# Altium project 3d_printer_housing.PrjPcb
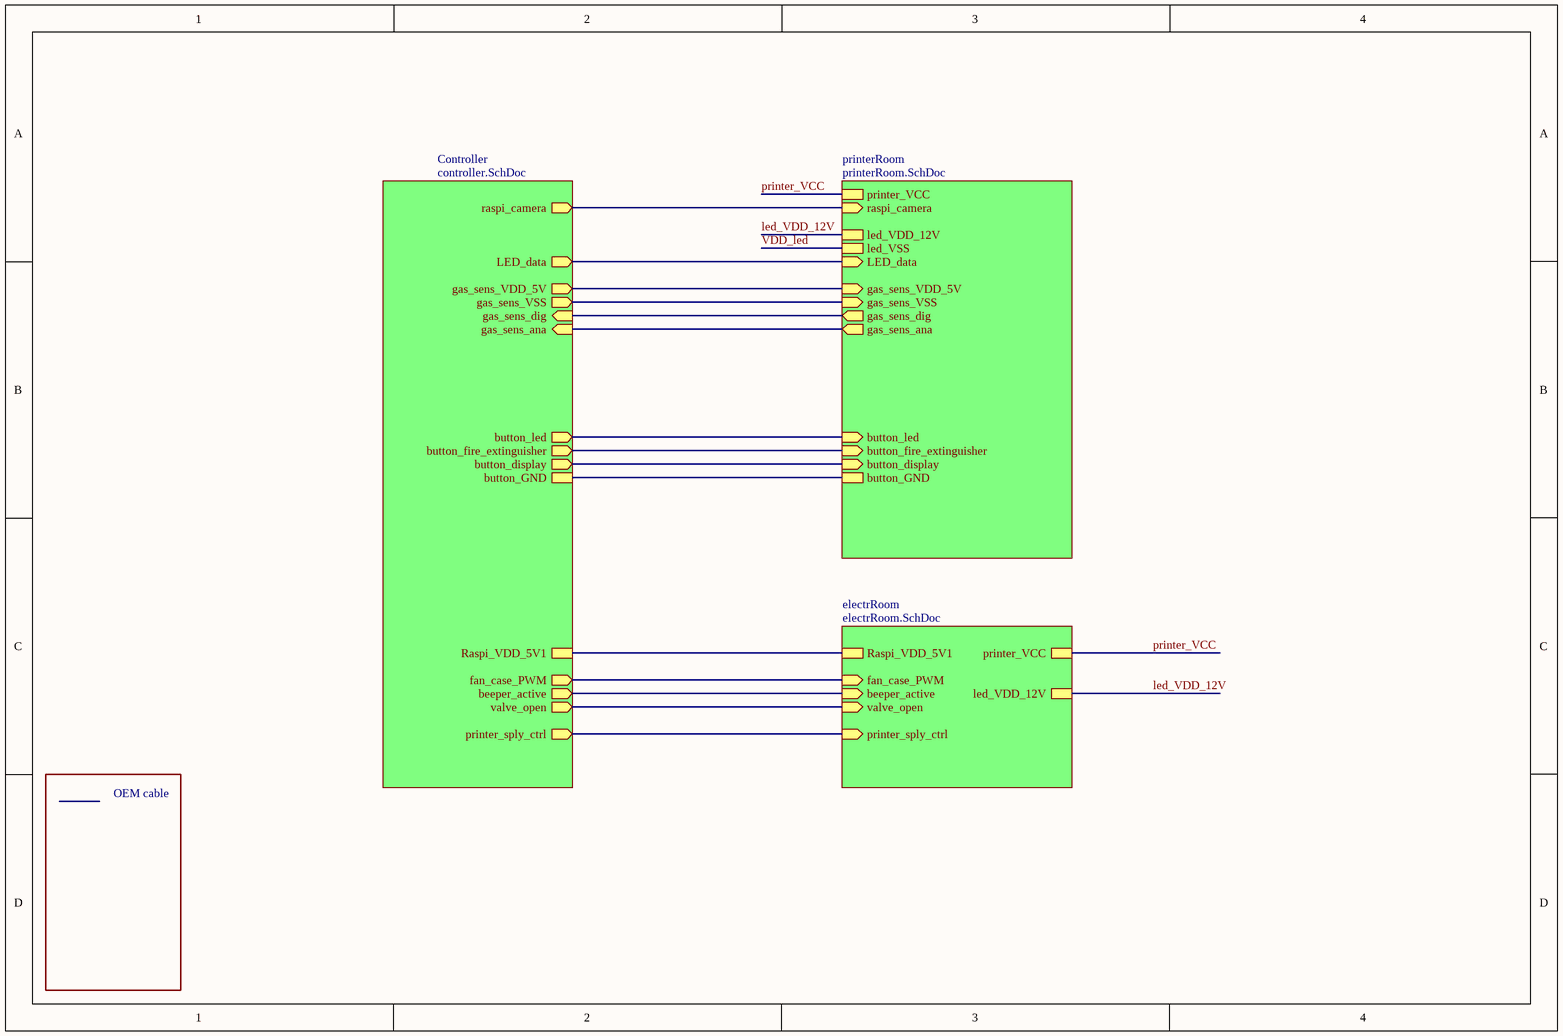
[diagram p0: 3d_printer_housing.SchDoc]
4 sheets, 5 parts. Net scope: hierarchical (ports join the sheet entries above them; power ports are global).
Sheets:
  3d_printer_housing.SchDoc
    Controller = controller.SchDoc
    electrRoom = electrRoom.SchDoc
    printerRoom = printerRoom.SchDoc

## Sheet 3d_printer_housing.SchDoc
size A4; SheetNumber: 1; SheetTotal: 3

### Sub-sheets
Controller = controller.SchDoc: gas_sens_dig (in), gas_sens_ana (in), button_display (out), button_led (out), LED_data (out), valve_open (out), beeper_active (out), button_fire_extinguisher (out), raspi_camera (out), gas_sens_VDD_5V (out), gas_sens_VSS (out), Raspi_VDD_5V1, button_GND, printer_sply_ctrl (out), fan_case_PWM (out)
electrRoom = electrRoom.SchDoc: printer_VCC, led_VDD_12V, valve_open (in), beeper_active (in), Raspi_VDD_5V1, fan_case_PWM (in), printer_sply_ctrl (in)
printerRoom = printerRoom.SchDoc: button_led (in), button_display (in), gas_sens_dig (out), gas_sens_ana (out), led_VDD_12V, LED_data (in), button_fire_extinguisher (in), button_GND, raspi_camera (in), gas_sens_VDD_5V (in), gas_sens_VSS (in), led_VSS, printer_VCC

### Nets
led_VDD_12V: sheet electrRoom/led_VDD_12V, sheet printerRoom/led_VDD_12V
VDD_led: sheet printerRoom/led_VSS
NetQ?#1_2: sheet Controller/fan_case_PWM, sheet electrRoom/fan_case_PWM
NetQ?#2_2: sheet Controller/printer_sply_ctrl, sheet electrRoom/printer_sply_ctrl
NetQ?#3_2: sheet Controller/valve_open, sheet electrRoom/valve_open
NetQ?#4_2: sheet Controller/beeper_active, sheet electrRoom/beeper_active
(unnamed): sheet Controller/gas_sens_dig, sheet printerRoom/gas_sens_dig
(unnamed): sheet Controller/gas_sens_ana, sheet printerRoom/gas_sens_ana
(unnamed): sheet Controller/button_display, sheet printerRoom/button_display
(unnamed): sheet Controller/button_led, sheet printerRoom/button_led
(unnamed): sheet Controller/LED_data, sheet printerRoom/LED_data
(unnamed): sheet Controller/button_fire_extinguisher, sheet printerRoom/button_fire_extinguisher
(unnamed): sheet Controller/gas_sens_VDD_5V, sheet printerRoom/gas_sens_VDD_5V
(unnamed): sheet Controller/gas_sens_VSS, sheet printerRoom/gas_sens_VSS
(unnamed): sheet Controller/button_GND, sheet printerRoom/button_GND

### Buses and harness runs
bus printer_VCC = sheet electrRoom/printer_VCC
bus printer_VCC = sheet printerRoom/printer_VCC
bus sheet Controller/raspi_camera = sheet printerRoom/raspi_camera
bus sheet Controller/Raspi_VDD_5V1 = sheet electrRoom/Raspi_VDD_5V1

### Notes on the sheet
- OEM cable

## Sheet controller.SchDoc
size A4; SheetNumber: 2; SheetTotal: 3; SPICEModelCacheHKYVZYBW: <root> / <DocumentId>HKYVZYBW</DocumentId> / </root>
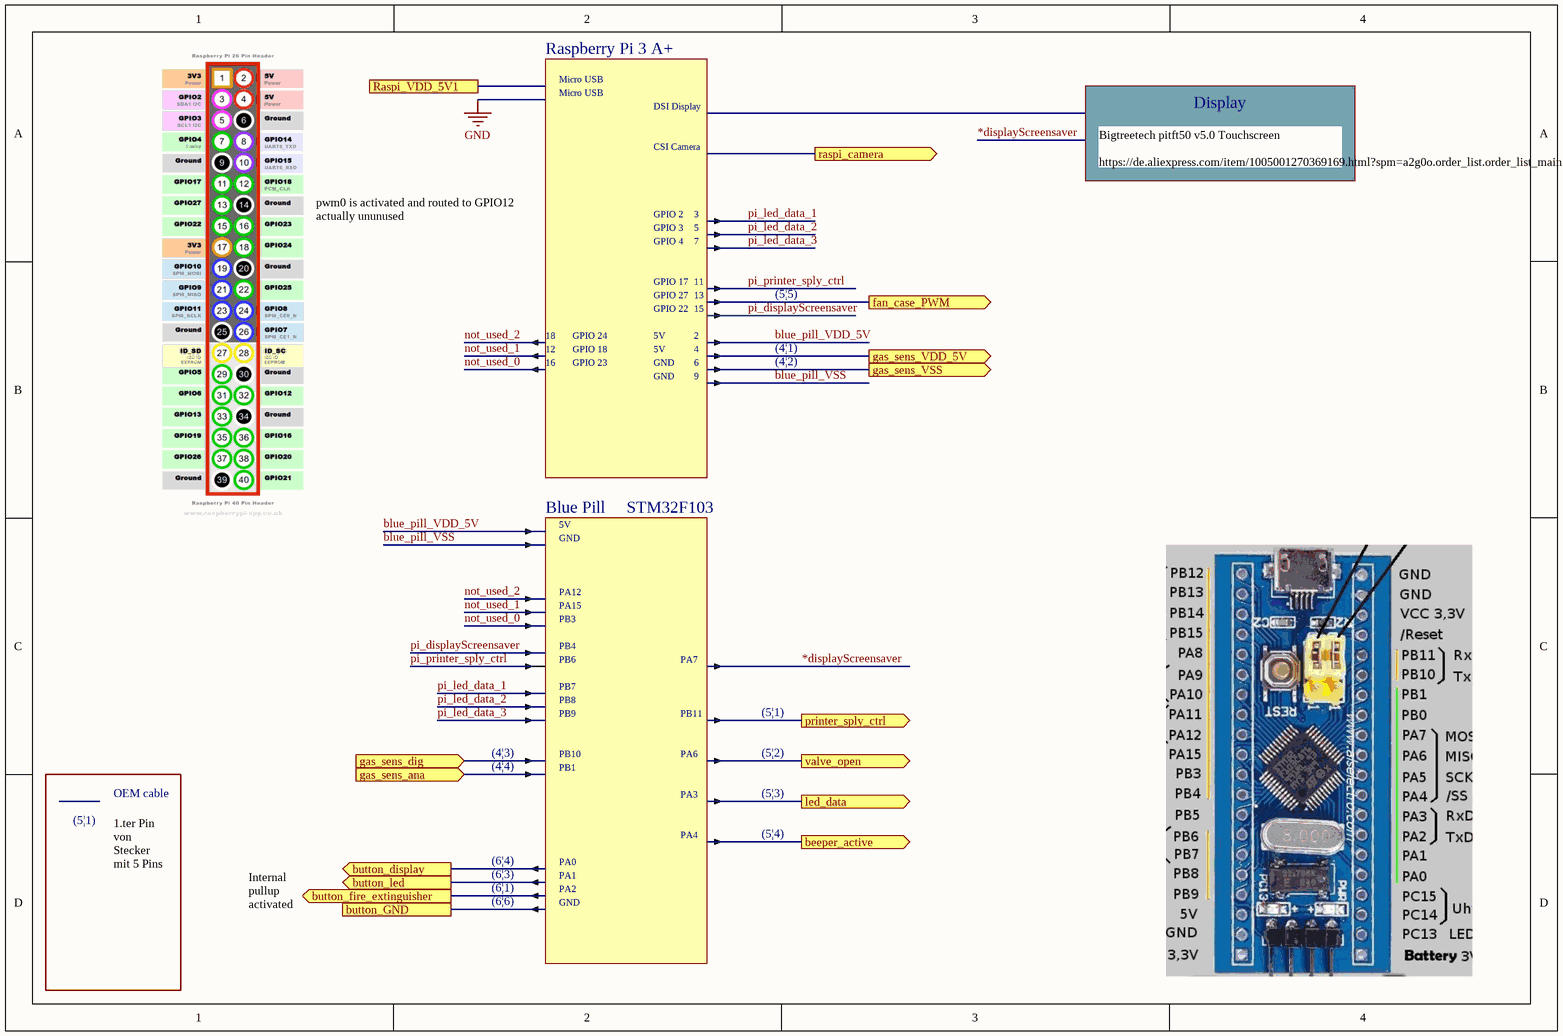
[diagram p1: controller.SchDoc]

### Ports
beeper_active (out), button_display (out), button_fire_extinguisher (out), button_GND, button_led (out), fan_case_PWM (out), gas_sens_ana (in), gas_sens_dig (in), gas_sens_VDD_5V (out), gas_sens_VSS (out), led_data (out), printer_sply_ctrl (out), raspi_camera (out), Raspi_VDD_5V1, valve_open (out)

### Notes on the sheet
- Raspberry Pi 3 A+
- Micro USB
- DSI Display
- Display
- CSI Camera
- Bigtreetech pitft50 v5.0 Touchscreen
  https://de.aliexpress.com/item/1005001270369169.html?spm=a2g0o.order_list.order_list_main.5.4e665c5flnb7hc&gatewayAdapt=glo2deu
- pwm0 is activated and routed to GPIO12
  actually ununused
- GPIO 2
- GPIO 3
- GPIO 4
- 3
- 5
- 7
- GPIO 17
- GPIO 27
- GPIO 22
- 11
- 13
- 15
- (5|5)
- 18
- 12
- 16
- GPIO 24
- GPIO 18
- GPIO 23
- 5V
- GND
- 2
- 9
- 6
- 4
- (4|1)
- (4|2)
- Blue Pill
- STM32F103
- PB4
- PB3
- PA15
- PA12
- PB7
- PB8
- PB9
- PB6
- PB11
- PA7
- (5|1)
- (4|3)
- (4|4)
- PB10
- PB1
- PA6
- (5|2)
- OEM cable
- PA4
- PA3
- (5|3)
- (5|4)
- 1.ter Pin von Stecker mit 5 Pins
- Internal pullup activated
- (6|1)
- (6|3)
- (6|4)
- (6|6)
- PA0
- PA1
- PA2

## Sheet electrRoom.SchDoc
size A4; SheetNumber: 3; SheetTotal: 3; SPICEModelCacheEMVUKTHD: <root> / <DocumentId>EMVUKTHD</DocumentId> / <CacheFrame Number="0"> / <Model Name="nmos" Kind="MDL"> / <Text>*Default N-Channel MOSFET / *Pinout: D,G,S / .MODEL NMOS NMOS()</Text> / </Model> / </CacheFrame> / </root>
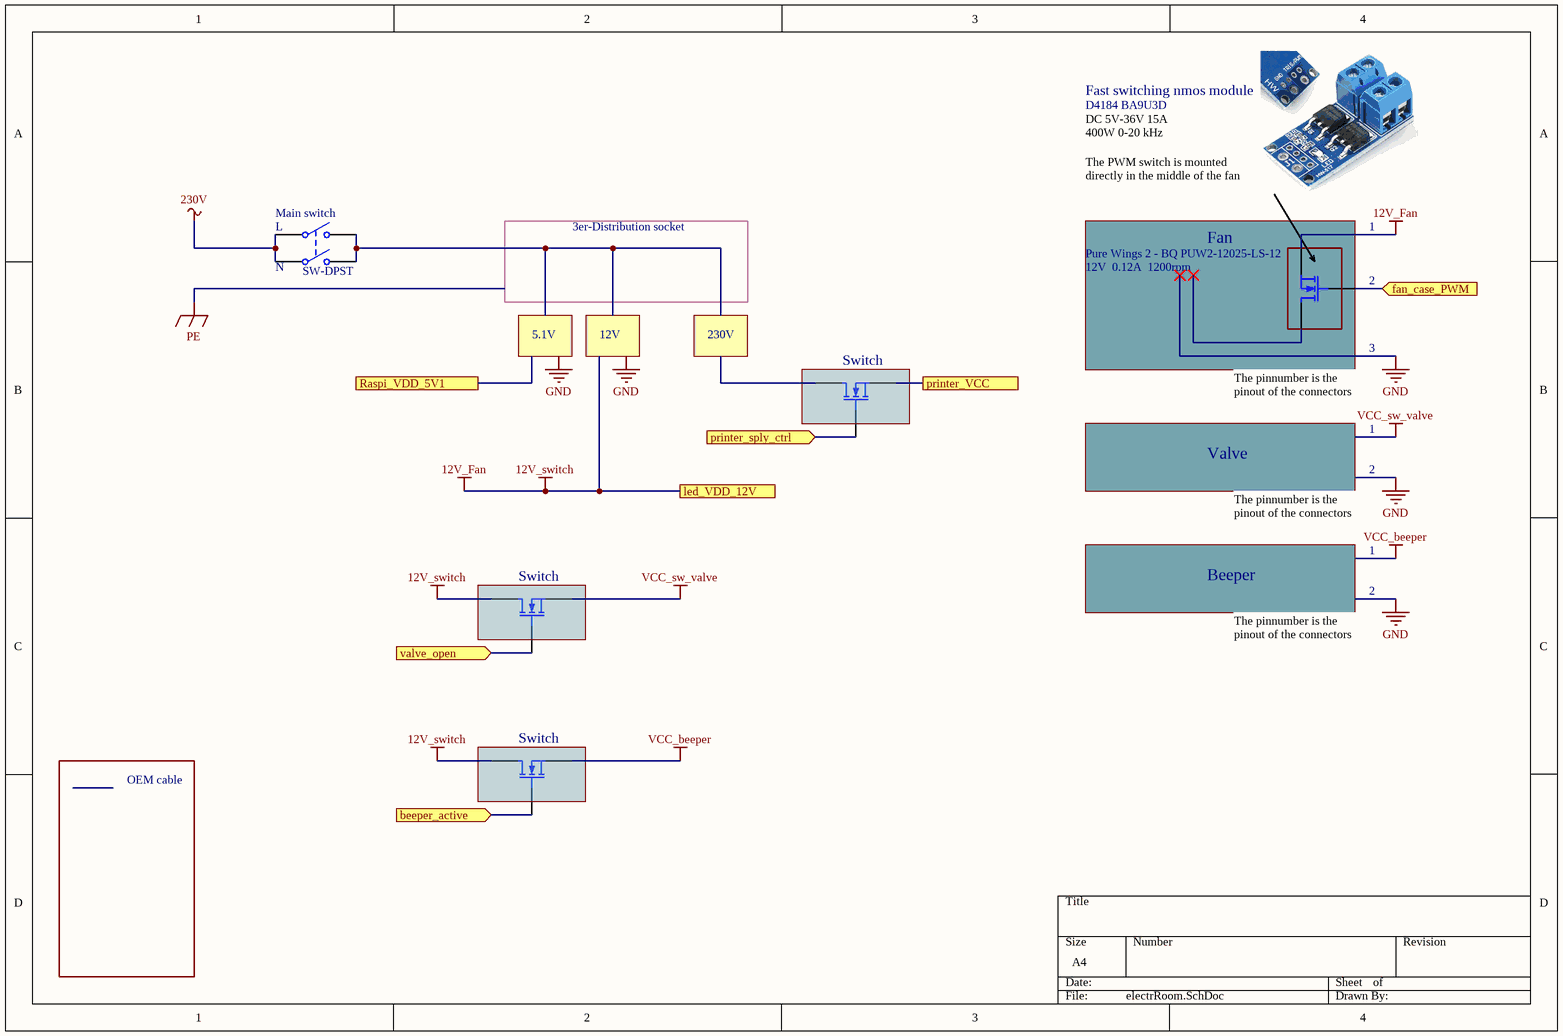
[diagram p2: electrRoom.SchDoc]

### Parts
(Parts that share a designator on the sheet are numbered #1, #2 ... from top to bottom, then left to right.)
Main_switch  SW-DPST  [DPST-4]
Q?#1  MOSFET-N  [E3]  (value not drawn)
Q?#2  MOSFET-N  [E3]  (value not drawn)
Q?#3  MOSFET-N  [E3]  (value not drawn)
Q?#4  MOSFET-N  [E3]  (value not drawn)

### Blocks framed on the sheet
Fan: Q?#1
Switch: Q?#2
Switch: Q?#3
Switch: Q?#4

### Ports
beeper_active (in), fan_case_PWM (in), led_VDD_12V, printer_sply_ctrl (in), printer_VCC, Raspi_VDD_5V1, valve_open (in)

### Nets
12V_Fan: Q?#1.3(S) Q?#3.1(D) Q?#4.1(D) ; port led_VDD_12V  [also labelled 12V_switch]  [project net led_VDD_12V]
230V: Main_switch.1(COMMON1) Main_switch.3(COMMON2)
VCC_beeper: Q?#4.3(S)
VCC_sw_valve: Q?#3.3(S)
NetMain_switch_2: Main_switch.2(NO1) Main_switch.4(NO2)
NetQ?#1_2: Q?#1.2(G) ; port fan_case_PWM
NetQ?#2_2: Q?#2.2(G) ; port printer_sply_ctrl
NetQ?#3_2: Q?#3.2(G) ; port valve_open
NetQ?#4_2: Q?#4.2(G) ; port beeper_active

Not connected (* = marked no-connect by the designer): Q?#1 1(D)*; Q?#2 1(D) 3(S)

### Notes on the sheet
- Fast switching nmos module
- D4184 BA9U3D
- DC 5V-36V 15A
- 400W 0-20 kHz
- The PWM switch is mounted directly in the middle of the fan
- (near Main_switch) L
- 3er-Distribution socket
- 1
- (near Main_switch) N
- (near Q?#1) Pure Wings 2 - BQ PUW2-12025-LS-12
- 12V  0.12A  1200rpm
- (near Q?#1) 2
- 5.1V
- 12V
- 230V
- 3
- The pinnumber is the pinout of the connectors
- Valve
- 2
- Beeper
- OEM cable
- Labels drawn without touching a wire or pin: GND

### Library data of the parts
Main_switch = SW-DPST: Double-Pole, Single-Throw Switch; Published: 24-Mar-1999; LatestRevisionDate: 17-Jul-2002; LatestRevisionNote: Re-released for DXP Platform.; PackageReference: DPST-4; Publisher: Altium Limited; PackageDescription: Switch; 4 Leads
Q?#1-Q?#4 = MOSFET-N: N-Channel MOSFET; Published: 8-Jun-2000; LatestRevisionDate: 17-Jul-2002; LatestRevisionNote: Re-released for DXP Platform.; PackageVersion: 1995/1996; PackageReference: E3; Publisher: Altium Limited; PackageDescription: TO, Flat Index; 3 In-Line, Axial Leads; Body Dia. 4.6mm; Lead Dia. 0.5 mm (max)

## Sheet printerRoom.SchDoc
size A4
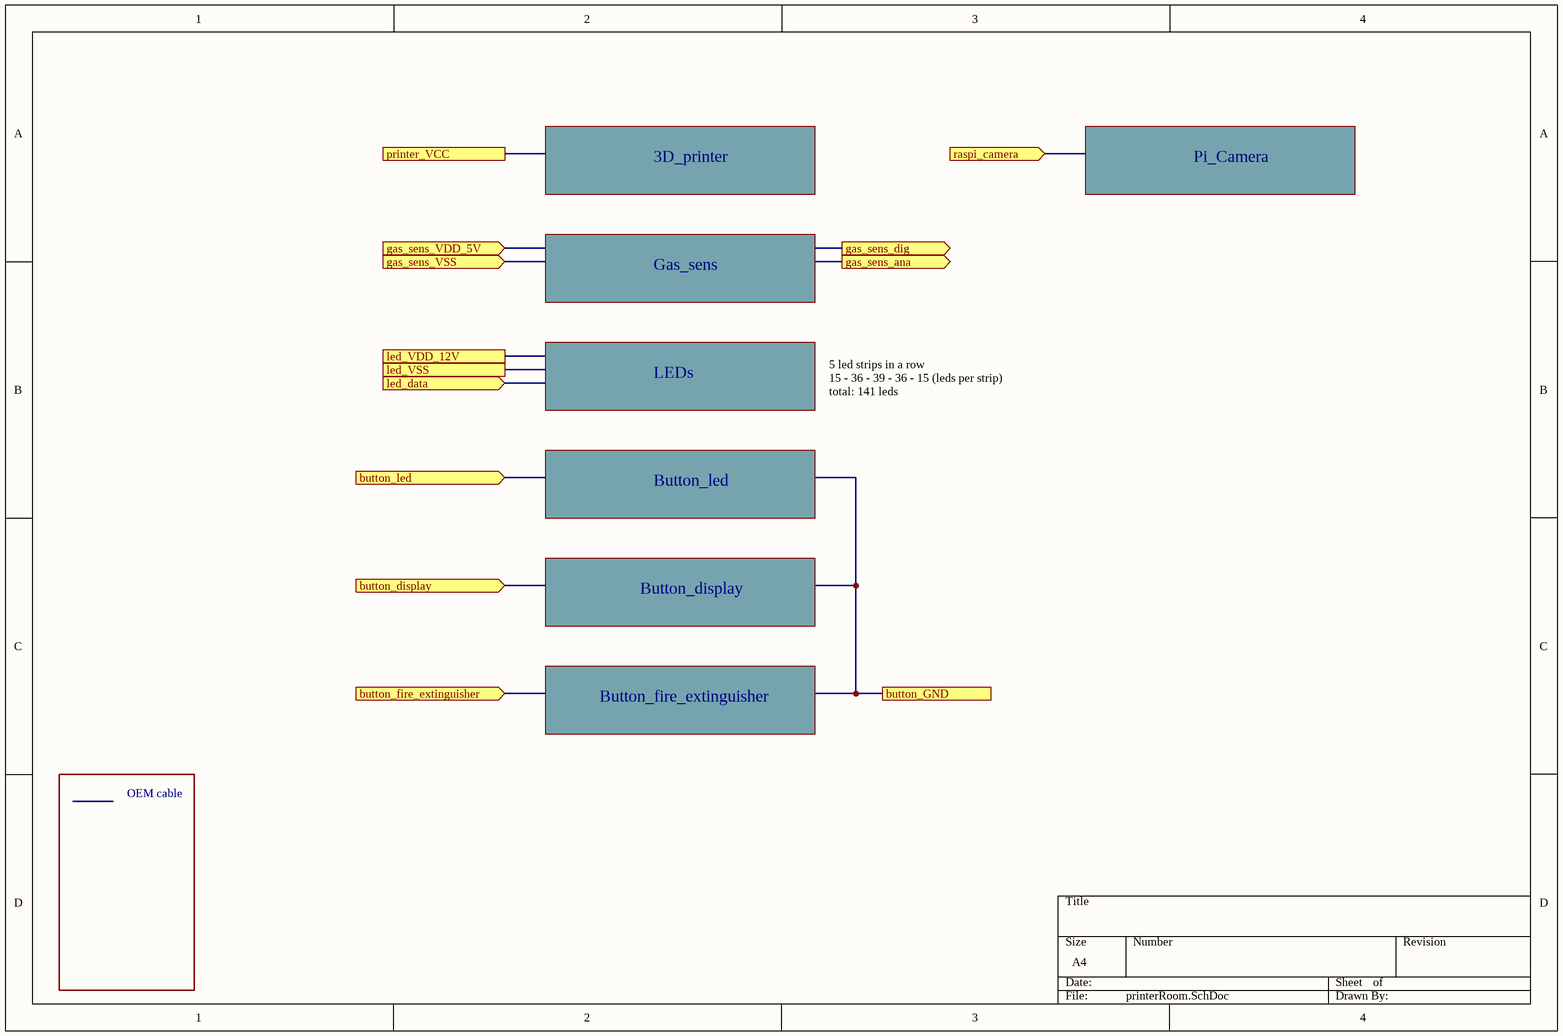
[diagram p3: printerRoom.SchDoc]

### Ports
button_display (in), button_fire_extinguisher (in), button_GND, button_led (in), gas_sens_ana (out), gas_sens_dig (out), gas_sens_VDD_5V (in), gas_sens_VSS (in), led_data (in), led_VDD_12V, led_VSS, printer_VCC, raspi_camera (in)

### Notes on the sheet
- 3D_printer
- Pi_Camera
- Gas_sens
- LEDs
- 5 led strips in a row
  15 - 36 - 39 - 36 - 15 (leds per strip)
  total: 141 leds
- Button_led
- Button_display
- Button_fire_extinguisher
- OEM cable